# EAGLE design NixiTubeClock (EAGLE 9.5.2)

## Sheet 1 of 3
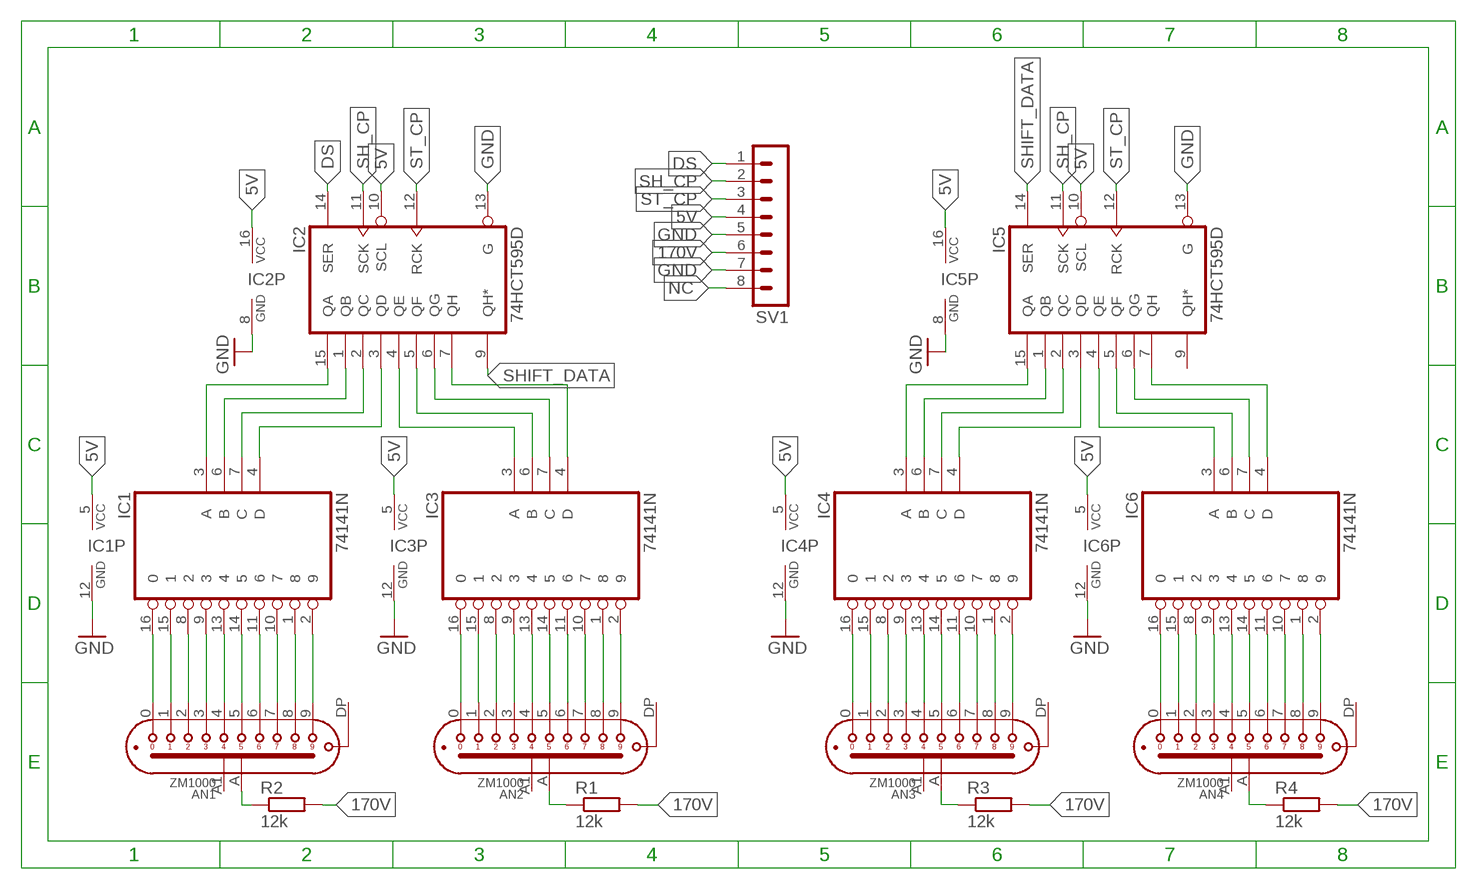
[diagram p0: schematic, sheet 1]

### Parts
AN1  ZM1000  [ZM1000]
AN2  ZM1000  [ZM1000]
AN3  ZM1000  [ZM1000]
AN4  ZM1000  [ZM1000]
IC1  74141N  [DIL16]
IC2  74HCT595D  [SO16]
IC3  74141N  [DIL16]
IC4  74141N  [DIL16]
IC5  74HCT595D  [SO16]
IC6  74141N  [DIL16]
R1  12k  R-EU_1206R1206  [R1206]
R2  12k  R-EU_1206R1206  [R1206]
R3  12k  R-EU_1206R1206  [R1206]
R4  12k  R-EU_1206R1206  [R1206]
SV1  MA08-1  [MA08-1]

### Nets
5V: IC1.5(VCC) IC2.10(SCL) IC2.16(VCC) IC3.5(VCC) IC4.5(VCC) IC5.10(SCL) IC5.16(VCC) IC6.5(VCC) SV1.4
170V: R1.2 R2.2 R3.2 R4.2 SV1.6
DS: IC2.14(SER) SV1.1
GND: IC1.12(GND) IC2.8(GND) IC2.13(G) IC3.12(GND) IC4.12(GND) IC5.8(GND) IC5.13(G) IC6.12(GND) SV1.5 SV1.7
N$1: IC4.4(D) IC5.3(QD)
N$7: AN1.0 IC1.16
N$9: AN1.1 IC1.15
N$13: AN1.2 IC1.8
N$15: AN1.3 IC1.9
N$16: AN1.4 IC1.13
N$17: AN1.5 IC1.14
N$18: AN1.6 IC1.11
N$19: AN1.7 IC1.10
N$20: AN1.8 IC1.1
N$21: AN1.9 IC1.2
N$22: AN2.0 IC3.16
N$23: AN2.1 IC3.15
N$24: AN2.2 IC3.8
N$25: AN2.3 IC3.9
N$26: AN2.4 IC3.13
N$27: AN2.5 IC3.14
N$28: AN2.6 IC3.11
N$29: AN2.7 IC3.10
N$30: AN2.8 IC3.1
N$31: AN2.9 IC3.2
N$32: AN3.0 IC4.16
N$35: AN3.1 IC4.15
N$36: AN3.2 IC4.8
N$66: AN3.3 IC4.9
N$67: AN3.4 IC4.13
N$68: AN3.5 IC4.14
N$69: AN3.6 IC4.11
N$70: AN3.7 IC4.10
N$71: AN3.8 IC4.1
N$72: AN3.9 IC4.2
N$73: AN4.0 IC6.16
N$74: AN4.1 IC6.15
N$75: AN4.2 IC6.8
N$76: AN4.3 IC6.9
N$91: AN4.4 IC6.13
N$92: AN4.5 IC6.14
N$93: AN4.6 IC6.11
N$94: AN4.7 IC6.10
N$95: AN4.8 IC6.1
N$96: AN4.9 IC6.2
N$97: AN1.A(A1) R2.1
N$98: AN2.A(A1) R1.1
N$99: AN3.A(A1) R3.1
N$100: AN4.A(A1) R4.1
N$101: IC1.3(A) IC2.15(QA)
N$102: IC1.6(B) IC2.1(QB)
N$103: IC1.7(C) IC2.2(QC)
N$104: IC1.4(D) IC2.3(QD)
N$105: IC2.4(QE) IC3.3(A)
N$106: IC2.5(QF) IC3.6(B)
N$107: IC2.6(QG) IC3.7(C)
N$108: IC2.7(QH) IC3.4(D)
N$109: IC4.3(A) IC5.15(QA)
N$110: IC4.6(B) IC5.1(QB)
N$111: IC4.7(C) IC5.2(QC)
N$113: IC5.4(QE) IC6.3(A)
N$114: IC5.5(QF) IC6.6(B)
N$115: IC5.6(QG) IC6.7(C)
N$116: IC5.7(QH) IC6.4(D)
NC: SV1.8
SH_CP: IC2.11(SCK) IC5.11(SCK) SV1.2
SHIFT_DATA: IC2.9(QH*) IC5.14(SER)
ST_CP: IC2.12(RCK) IC5.12(RCK) SV1.3
Unconnected: AN1.A1(A2) AN1.DP(DPL) AN2.A1(A2) AN2.DP(DPL) AN3.A1(A2) AN3.DP(DPL) AN4.A1(A2) AN4.DP(DPL) IC5.9(QH*)

## Sheet 2 of 3
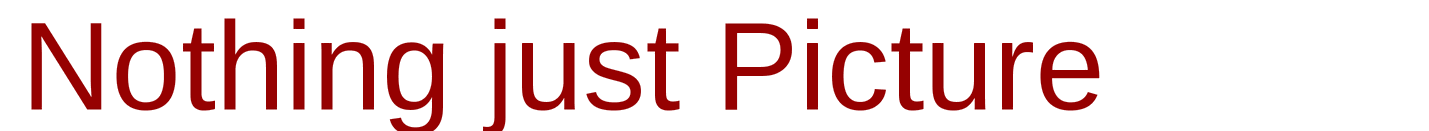
[diagram p1: schematic, sheet 2]

### Notes on the sheet
- Nothing just Picture

## Sheet 3 of 3

## Library data of the parts
AN1-AN4 = NixieTube:ZM1000: Indicator Tube (numeral height 14mm, no filter, side view, long-life typ)
IC1 IC3 IC4 IC6 = NixieTube:74*141: BCD to decimal DECODER/DRIVER
IC2 IC5 = NixieTube:74*595: 8-bit SHIFT REGISTER, output latch
R1-R4 = CommonParts:R-EU_1206: RESISTOR, European symbol
SV1 = con-lstb:MA08-1: PIN HEADER; OC_FARNELL: unknown; OC_NEWARK: unknown

## Net classes
0 default: width 0.2 mm, drill 0.3 mm, clearance 0.1 mm
1 other: width 0.2 mm, drill 0.2 mm, clearance 0.1 mm

## Board
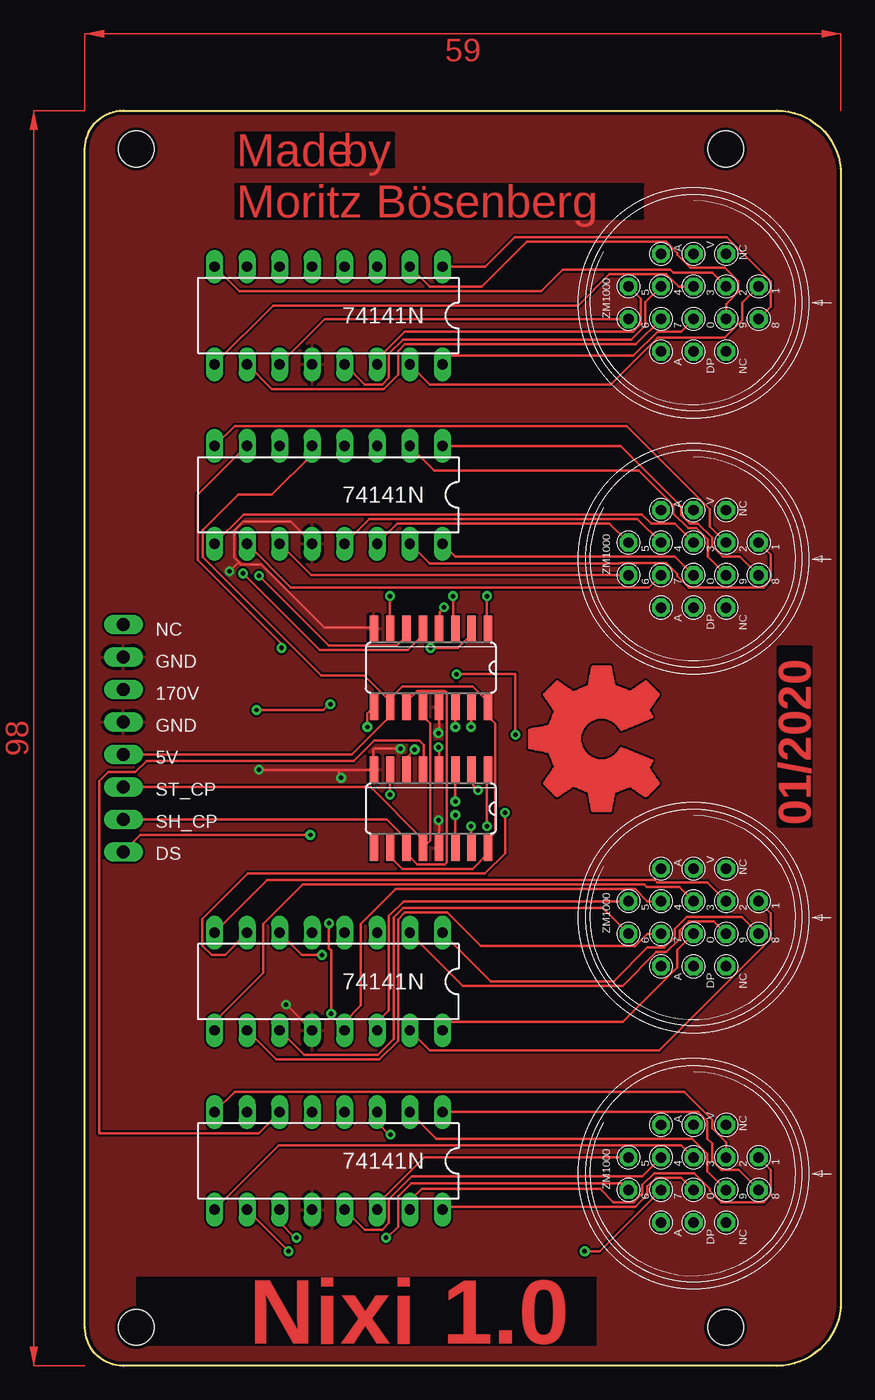
[diagram p2: board, top side]
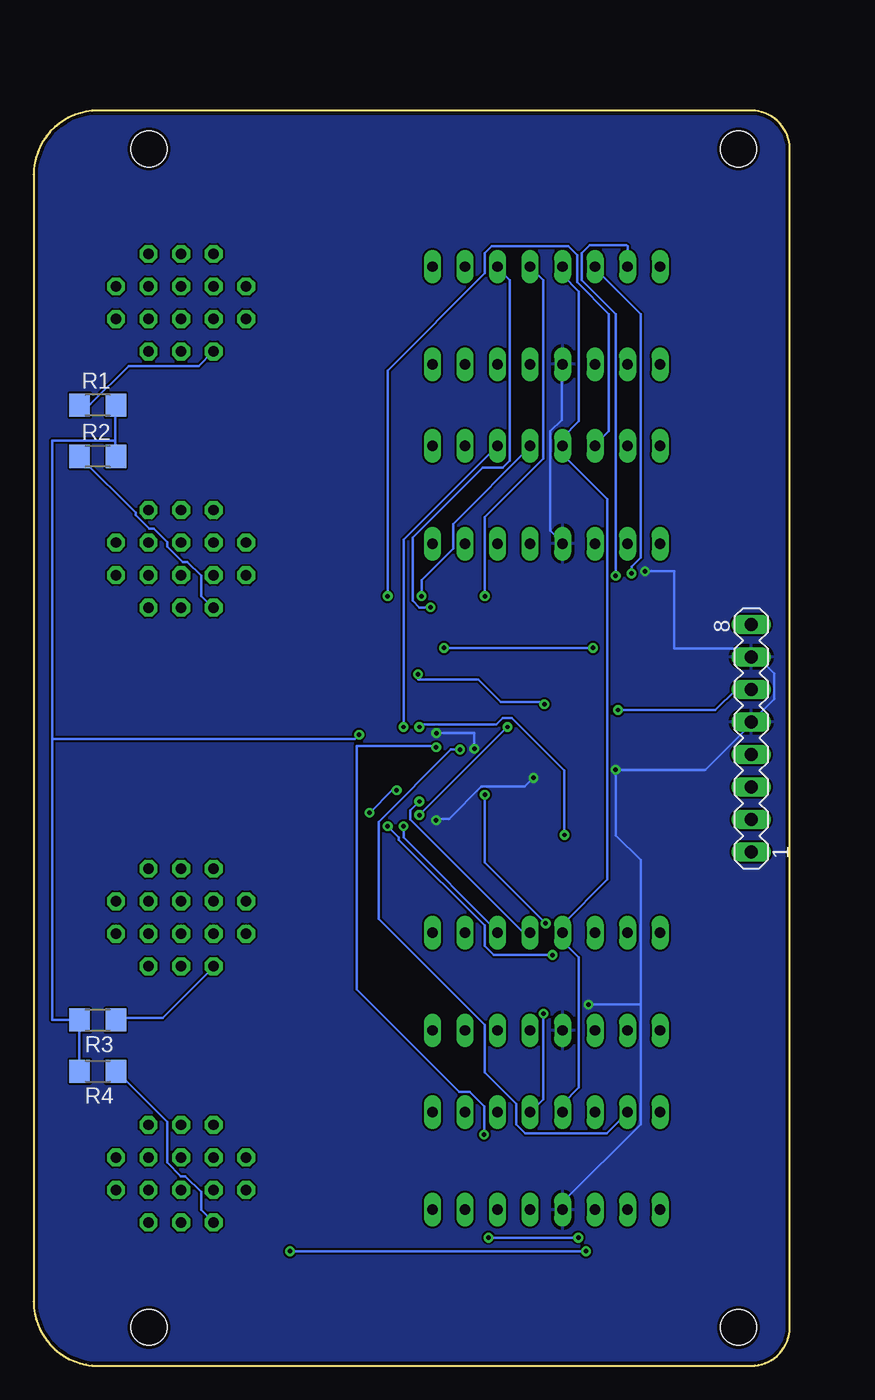
[diagram p3: board, bottom side, seen from below]

Size 59 x 98 mm. Coordinates in mm from the lower left corner, seen from the top.
Outline: 3,98 54,98 arc-90 59,93 59,5 arc-90 54,0 3,0 arc-90 0,3 0,95 arc-90 3,98
Copper layers (1*16): Top 0.035mm / dielectric 1.5mm / Bottom 0.035mm
Design rules "default *": minimum track width 6mil, minimum drill 0.35mm, track to track 6mil, track to pad 6mil, pad to pad 6mil, via to via 6mil, smd to smd 6mil, copper to edge 10mil, drill to drill 6mil, minimum pad ring 10mil, minimum via ring 8mil, stop-mask expansion 4mil, vias tented up to drill 0mil, thermal gap 10mil
Holes 2.8 mm at 4,95 50,95 50,3 4,3

### Footprints (pad centres in the part's own frame; a part is rotated, then mirrored left to right if it is on the bottom)
ZM1000 = drill 0.813 pad 1.397 octagon: 0 -1.27,0; 1 1.27,-5.08; 2 1.27,-2.54; 3 1.27,0; 4 1.27,2.54; 5 1.27,5.08; 6 -1.27,5.08; 7 -1.27,2.54; 8 -1.27,-5.08; 9 -1.27,-2.54; A -3.81,2.54; A1 3.81,2.54; DP -3.81,0; NC1 3.81,-2.54; NC2 -3.81,-2.54; V 3.81,0
DIL16 = drill 0.813 long: 1 -8.89,-3.81; 2 -6.35,-3.81; 3 -3.81,-3.81; 4 -1.27,-3.81; 5 1.27,-3.81; 6 3.81,-3.81; 7 6.35,-3.81; 8 8.89,-3.81; 9 8.89,3.81; 10 6.35,3.81; 11 3.81,3.81; 12 1.27,3.81; 13 -1.27,3.81; 14 -3.81,3.81; 15 -6.35,3.81; 16 -8.89,3.81
SO16 = smd 0.66 x 2.032: 1 -4.445,-3.073; 2 -3.175,-3.073; 3 -1.905,-3.073; 4 -0.635,-3.073; 5 0.635,-3.073; 6 1.905,-3.073; 7 3.175,-3.073; 8 4.445,-3.073; 9 4.445,3.073; 10 3.175,3.073; 11 1.905,3.073; 12 0.635,3.073; 13 -0.635,3.073; 14 -1.905,3.073; 15 -3.175,3.073; 16 -4.445,3.073
R1206 = smd 1.6 x 1.803: 1 -1.422,0; 2 1.422,0
MA08-1 = drill 1.016 long: 1 -8.89,0; 2 -6.35,0; 3 -3.81,0; 4 -1.27,0; 5 1.27,0; 6 3.81,0; 7 6.35,0; 8 8.89,0

### Placement (x,y rotation side)
AN1  47.5,63 90 top
AN2  47.5,83 90 top
AN3  47.5,35 90 top
AN4  47.5,15 90 top
IC1  19,68 180 top
IC2  27,54.5 180 top
IC3  19,82 180 top
IC4  19,30 180 top
IC5  27,43.5 180 top
IC6  19,16 180 top
R1  54,75 0 bottom
R2  54,71 0 bottom
R3  54,27 180 bottom
R4  54,23 180 bottom
SV1  3,49 90 bottom

### Tracks (layer width: path | path; a pad name or v marks a point on that pad's centre or on a via)
5V
  Top 0.2: IC5.10 23.82,39.74 24.76,38.81 30.26,38.81 31.45,39.99 IC5.16 31.45,41.11 32.03,41.7 32.03,50.16 31.45,50.74 IC2.16 31.45,51.86 30.26,53.05 24.76,53.05 23.82,52.11 IC2.10 | IC1.5 17.73,71.15 14.58,68 11.97,68 9.2,65.23 9.2,63.15 18.45,53.9 21.79,53.9 23.82,51.86 IC2.10 | SV1.4 20.81,47.73 23.82,50.74 IC2.10
  Bottom 0.2: IC3.5 17.73,85.15 16.46,83.88 16.46,73.74 17.73,72.47 IC1.5 17.73,71.15 14.25,67.67 14.25,37.95 17.73,34.47 IC4.5 17.73,33.15 16.46,31.88 16.46,21.74 17.73,20.47 IC6.5
170V  (via drill 0.35)
  Top 0.2: v13.4,51.2 18.6,51.2 19.1,51.7 v19.15,51.65 | v33.6,49.27 33.6,54 v29,54
  Bottom 0.2: SV1.6 4.19,52.81 5.8,51.2 v13.4,51.2 | R4.2 55.45,23.09 55.45,26.97 R3.2 57.57,27 57.57,48.92 | 52.64,72.25 52.64,74.89 R1.2 | 52.64,72.25 52.64,71.02 R2.2 | 57.57,48.92 57.57,72.25 52.64,72.25 | 57.57,48.92 33.95,48.92 v33.6,49.27 | v19.15,51.65 19.21,51.81 22.56,51.81 24.32,53.57 29,53.57 v29,54
DS  (via drill 0.35)
  Top 0.2: v28.91,49.87 28.91,51.28 IC2.14 | v17.59,41.45 4.32,41.45 3.05,40.18 SV1.1
  Bottom 0.2: v28.91,49.87 28.71,50.07 22.89,50.07 22.39,50.58 21.68,50.58 17.59,46.48 v17.59,41.45
GND  (via drill 0.35)
  Top 0.2: 11.99,62.74 11.64,63.09 11.64,65.2 12.34,65.91 16.04,65.91 17.63,64.32 IC1.12 | 11.99,62.74 12.17,62.56 13.75,62.56 18.69,57.63 22.39,57.63 IC2.8 | v13.58,46.53 19.8,46.53 | 19.8,46.53 22.39,46.53 IC5.8 22.5,46.63 22.5,48.1 22.59,48.19 v24.61,48.19 | v15.69,28.2 17.63,26.26 IC4.12 | v11.29,62.03 11.99,62.74 | IC2.13 27.64,49.4 v27.58,49.4 | 19.8,46.53 19.8,45.9 19.9,45.8 v20,45.9 | v27.59,42.6 27.64,42.55 IC5.13
  Bottom 0.2: IC3.12 17.8,78.07 17.8,73.84 18.69,72.96 18.69,65.2 17.8,64.32 IC1.12 | 11.64,28.2 11.64,39.48 13.58,41.42 v13.58,46.53 6.58,46.53 2.88,50.23 SV1.5 1.22,52.05 1.22,54.05 2,54.82 2.47,54.82 SV1.7 3.65,56 9,56 9,62.03 v11.29,62.03 | 11.64,28.2 11.64,18.86 17.63,12.87 17.63,12.34 IC6.12 | 11.64,28.2 v15.69,28.2 | v27.58,49.4 24.6,49.4 v24.6,48.2 v24.61,48.19 | v20,45.9 20.68,45.22 24.06,45.22 26.58,42.7 27.6,42.7 27.6,42.61 v27.59,42.6
  pour Top: 3,98 54,98 arc-90 59,93 59,5 arc-90 54,0 3,0 arc-90 0,3 0,95 arc-90
  pour Bottom: 3,98 54,98 arc-90 59,93 59,5 arc-90 54,0 3,0 arc-90 0,3 0,95 arc-90
N$1  (via drill 0.35)
  Top 0.2: v28.91,44.06 28.91,46.53 IC5.3
  Bottom 0.2: v28.91,44.06 29.61,43.35 29.61,42.65 20.8,33.84 20.27,33.84 IC4.4
N$7
  Top 0.2: AN1.0 46.04,63.19 28.89,63.19 IC1.16
N$9
  Top 0.2: AN1.1 53.53,63.32 53.53,61.34 52.97,60.78 47.11,60.78 46.23,61.66 46.23,61.8 45.35,62.68 41.73,62.68 41.66,62.62 26.92,62.62 IC1.15
N$13
  Top 0.2: AN1.2 48.77,65.54 48.77,66.89 42.27,73.38 11.68,73.38 IC1.8
N$15
  Top 0.2: AN1.3 46.02,65.75 44.2,65.75 43.47,66.47 12.39,66.47 IC1.9
N$16
  Top 0.2: AN1.4 43.11,66.12 22.2,66.12 IC1.13
N$17
  Top 0.2: AN1.5 40.93,65.76 24.38,65.76 IC1.14
N$18
  Top 0.2: AN1.6 17.65,61.73 IC1.11
N$19
  Top 0.2: AN1.7 44.01,60.78 16.06,60.78 IC1.10
N$20
  Top 0.2: AN1.8 51.12,63.19 49.77,63.19 48.96,64 48.96,64.65 47.84,65.77 47.19,65.77 46.55,66.42 46.55,67.06 41.8,71.81 IC1.1
N$21
  Top 0.2: AN1.9 48.61,63.16 48.61,64.51 47.71,65.4 47.06,65.4 45.93,66.53 45.93,67.18 43.23,69.89 27.27,69.89 IC1.2
N$22
  Top 0.2: AN2.0 46.53,80.76 44.69,80.76 42.78,78.85 28.55,78.85 IC3.16
N$23
  Top 0.2: AN2.1 51.31,83 51.31,81.66 49.92,80.27 44.7,80.27 41.04,76.62 26.92,76.62 IC3.15
N$24
  Top 0.2: AN2.2 48.98,85.33 45.92,85.33 45.68,85.57 37.3,85.57 35.61,83.88 12.04,83.88 IC3.8
N$25
  Top 0.2: AN2.3 46.33,84.27 45.38,85.22 40.93,85.22 38.5,82.79 14.71,82.79 IC3.9
N$26
  Top 0.2: AN2.4 43.72,83.03 43.72,81.19 42.65,80.12 24.83,80.12 23.72,79.01 23.72,77.15 23.19,76.62 21.84,76.62 IC3.13
N$27
  Top 0.2: AN2.5 43.37,83.32 43.37,81.34 42.79,80.75 24.96,80.75 22.81,78.6 IC3.14
N$28
  Top 0.2: AN2.6 18.73,81.73 IC3.11
N$29
  Top 0.2: AN2.7 42.99,79.76 24.97,79.76 24.44,79.23 24.44,77.37 23.33,76.26 14.58,76.26 IC3.10
N$30
  Top 0.2: AN2.8 53.53,82.68 53.53,84.66 50.08,88.11 33.56,88.11 31.26,85.81 IC3.1
N$31
  Top 0.2: AN2.9 50.04,82.9 50.99,83.85 50.99,84.66 49.93,85.72 47.24,85.72 46.23,86.73 46.23,86.89 45.35,87.76 34.49,87.76 30.97,84.24 26.92,84.24 IC3.2
N$32
  Top 0.2: AN3.0 46.23,32.46 46.23,31.11 41.97,26.85 28.55,26.85 IC4.16
N$35
  Top 0.2: AN3.1 53.53,35.32 53.53,33.34 44.81,24.62 26.92,24.62 IC4.15
N$36
  Top 0.2: AN3.2 48.58,37.73 44.67,37.73 44.48,37.93 14.23,37.93 IC4.8
N$66
  Top 0.2: AN3.3 46.39,37.38 43.85,37.38 43.66,37.57 17,37.57 13.92,34.49 13.92,30.66 10.11,26.85 IC4.9
N$67
  Top 0.2: AN3.4 43.9,36.27 42.94,37.22 24.27,37.22 21.54,34.49 21.54,28.12 20.27,26.85 IC4.13
N$68
  Top 0.2: AN3.5 24.86,36.27 23.72,35.13 23.72,27.76 22.81,26.85 IC4.14
N$69
  Top 0.2: AN3.6 40.41,35.74 24.83,35.74 24.08,34.99 24.08,25.51 22.84,24.27 17.11,24.27 IC4.11
N$70
  Top 0.2: AN3.7 43.9,33.73 42.94,32.78 30.87,32.78 28.27,35.38 24.97,35.38 24.44,34.85 24.44,25.37 22.98,23.91 14.93,23.91 IC4.10
N$71
  Top 0.2: AN3.8 51.28,35.03 46.96,35.03 46.04,34.11 46.04,33.47 45.23,32.65 43.88,32.65 41.26,30.03 31.67,30.03 IC4.1
N$72
  Top 0.2: AN3.9 49.09,34.68 47.11,34.68 46.42,33.99 46.42,33.35 45.37,32.3 44.59,32.3 41.97,29.68 29.48,29.68 IC4.2
N$73
  Top 0.2: AN4.0 46.55,14.68 44.57,14.68 43.9,14.01 43.9,13.36 42.96,12.43 27.89,12.43 IC6.16
N$74
  Top 0.2: AN4.1 53.53,15.32 53.53,13.34 52.97,12.78 49.65,12.78 48.77,13.65 48.77,13.8 47.54,15.03 44.42,15.03 43.51,14.12 43.51,13.47 42.81,12.78 41.24,12.78 40.22,13.8 26.3,13.8 25.35,12.85 IC6.15
N$75
  Top 0.2: AN4.2 50.04,17.44 48.96,18.52 48.96,19.19 46.77,21.38 11.68,21.38 IC6.8
N$76
  Top 0.2: AN4.3 46.55,17.22 15.14,17.22 IC6.9
N$91
  Top 0.2: AN4.4 43.49,14.8 25.51,14.8 23.72,13.01 23.72,11.15 23.19,10.62 21.84,10.62 IC6.13 20.27,11.53
N$92
  Top 0.2: AN4.5 26.48,16.27 22.81,12.6 IC6.14
N$93  (via drill 0.35)
  Top 0.2: AN4.6 41.9,14.25 25.46,14.25 24.44,13.23 24.44,10.87 23.57,10 v23.5,10 | IC6.11 15.19,11.19 16.38,10 v16.5,10
  Bottom 0.2: v16.5,10 v23.5,10
N$94  (via drill 0.35)
  Top 0.2: AN4.7 40.17,8.94 v39,8.94 | IC6.10 v15.9,8.94
  Bottom 0.2: v15.9,8.94 v39,8.94
N$95
  Top 0.2: AN4.8 51.01,15.3 49.66,15.3 48.96,16 48.96,17.35 48.58,17.73 48.58,19.07 47.84,19.81 IC6.1
N$96
  Top 0.2: AN4.9 48.58,15.19 48.58,16.54 47.38,17.73 27.43,17.73 IC6.2
N$97
  Bottom 0.2: R2.1 55.28,70.84 51.05,66.61 51.05,66.44 49.99,65.38 49.64,65.38 48.58,64.32 48.58,63.97 47.35,62.74 47,62.74 45.94,61.68 45.94,60.09 45.06,59.21 AN1.A
N$98
  Bottom 0.2: R1.1 55.28,75.07 54.57,75.07 51.58,78.07 46.12,78.07 45.06,79.12 AN2.A
N$99
  Bottom 0.2: R3.1 52.46,27.14 48.94,27.14 45.06,31.02 AN3.A
N$100
  Bottom 0.2: R4.1 52.46,22.91 48.58,19.04 48.58,15.87 47.53,14.81 47.17,14.81 45.94,13.58 45.94,12.17 45.06,11.29 AN4.A
N$101  (via drill 0.35)
  Top 0.2: v30.14,49.87 30.14,51.28 IC2.15
  Bottom 0.2: v30.14,49.87 30.14,64.5 22.91,71.72 IC1.3
N$102  (via drill 0.35)
  Top 0.2: v31.37,60.09 31.37,57.63 IC2.1
  Bottom 0.2: v31.37,60.09 31.37,77.71 23.8,85.29 23.8,86.88 23.27,87.4 17.28,87.4 16.57,86.7 16.57,84.58 14.11,82.12 14.11,72.96 15.16,71.9 IC1.6
N$103  (via drill 0.35)
  Top 0.2: v26.97,56.04 29.08,56.04 30.14,57.1 30.14,57.45 IC2.2 | v15.34,56.04 15.34,56.39 8.82,62.91 8.82,68.02 12.52,71.72 IC1.7
  Bottom 0.2: v15.34,56.04 v26.97,56.04
N$104  (via drill 0.35)
  Top 0.2: v28.73,60.09 28.73,57.63 IC2.3
  Bottom 0.2: v28.73,60.09 28.73,61.33 26.26,63.79 26.26,65.73 20.27,71.72 IC1.4
N$105  (via drill 0.35)
  Top 0.2: v28.02,59.21 27.67,58.86 27.67,57.63 IC2.4
  Bottom 0.2: v28.02,59.21 28.91,59.21 29.43,59.74 29.43,64.67 23.97,70.14 22.39,70.14 21.86,70.67 21.86,84.76 22.74,85.64 IC3.3
N$106  (via drill 0.35)
  Top 0.2: v12.34,61.85 18.33,55.87 25.21,55.87 26.26,56.92 26.26,57.45 IC2.5
  Bottom 0.2: v12.34,61.85 12.34,62.38 11.64,63.09 11.64,82.12 15.16,85.64 IC3.6
N$107  (via drill 0.35)
  Top 0.2: v13.58,61.68 19.04,56.22 24.32,56.22 25.03,56.92 25.03,57.45 IC2.6
  Bottom 0.2: v13.58,61.68 13.58,82.12 16.22,84.76 16.22,86.88 15.6,87.5 12.75,87.5 12.65,87.4 IC3.7
N$108  (via drill 0.35)
  Top 0.2: v23.8,60.09 23.8,57.63 IC2.7
  Bottom 0.2: v23.8,60.09 23.8,66.26 19.21,70.84 19.21,84.76 20.1,85.64 IC3.4
N$109  (via drill 0.35)
  Top 0.2: v30.14,42.12 30.14,40.53 IC5.15
  Bottom 0.2: v30.14,42.12 30.14,41.24 22.74,33.84 IC4.3
N$110  (via drill 0.35)
  Top 0.2: v31.37,42.12 31.37,46.53 IC5.1 | v18.51,32.08 16.92,32.08 15.34,33.66 IC4.6
  Bottom 0.2: v31.37,42.12 30.49,41.24 30.49,41.06 23.8,34.37 23.8,32.78 23.09,32.08 v18.51,32.08
N$111  (via drill 0.35)
  Top 0.2: v30.67,44.94 30.32,45.29 30.32,46.53 IC5.2 | v32.78,43.18 32.78,40.01 31.2,38.42 12.7,38.42 9.17,34.9 9.17,32.78 9.88,32.08 10.93,32.08 12.52,33.66 IC4.7
  Bottom 0.2: v30.67,44.94 31.02,44.94 v32.78,43.18
N$113  (via drill 0.35)
  Top 0.2: IC6.3 22.81,18.99 23.8,18 v23.85,18.05 | IC5.4 27.64,48.25 v27.59,48.3 | IC5.4 27.7,46.51 27.7,46 27.64,46.06 IC5.4
  Bottom 0.2: v23.85,18.05 23.85,20.26 24.97,21.38 25.78,21.38 33.8,29.4 33.8,48.4 27.7,48.4 v27.6,48.3 v27.59,48.3
N$114
  Top 0.2: IC5.5 26.44,46.7 26.44,48.46 26.09,48.82 22.56,48.82 20.98,47.23 4.82,47.23 3.93,46.35 1.82,46.35 1.11,45.65 1.11,18.16 13.58,18.16 15.16,19.74 IC6.6
N$115  (via drill 0.35)
  Top 0.2: v25.73,48.11 25.21,47.58 25.21,46.7 IC5.6
  Bottom 0.2: v25.73,48.11 26.44,48.11 32.08,42.47 32.08,34.9 23.8,26.61 23.8,22.91 21.33,20.45 21.33,18.86 20.62,18.16 14.28,18.16 12.7,19.74 IC6.7
N$116  (via drill 0.35)
  Top 0.2: v23.8,44.59 23.8,46.53 IC5.7 | v19.04,34.54 19.04,32.61 19.21,32.43 v19.21,27.5
  Bottom 0.2: v23.8,44.59 23.8,39.3 v19.04,34.54 | v19.21,27.5 19.21,20.8 20.1,19.92 IC6.4
SH_CP
  Top 0.2: SV1.2 23.56,42.65 25.09,41.11 IC5.11 25.09,39.99 25.93,39.16 28.07,39.16 28.22,39.31 28.22,52.55 28.07,52.7 25.93,52.7 25.09,51.86 IC2.11
SHIFT_DATA  (via drill 0.35)
  Top 0.2: v28.91,43 28.91,40.53 IC5.14 | v22.03,49.87 22.03,50.93 22.39,51.28 IC2.9
  Bottom 0.2: v22.03,49.87 v28.91,43
ST_CP
  Top 0.2: SV1.3 22.29,45.19 26.36,41.11 IC5.12 26.95,41.01 26.95,50.16 26.36,50.74 IC2.12
(copper drawn outside any net)
  shapes: Top area x371

### Text on the board
Top: Made | by | Moritz Bösenberg | 01/2020 | Nixi 1.0
tNames: NC | GND | 170V | GND | 5V | ST_CP | SH_CP | DS
tStop: Made | by | Moritz Bösenberg | 01/2020 | Nixi 1.0
tKeepout: Nixi 1.0